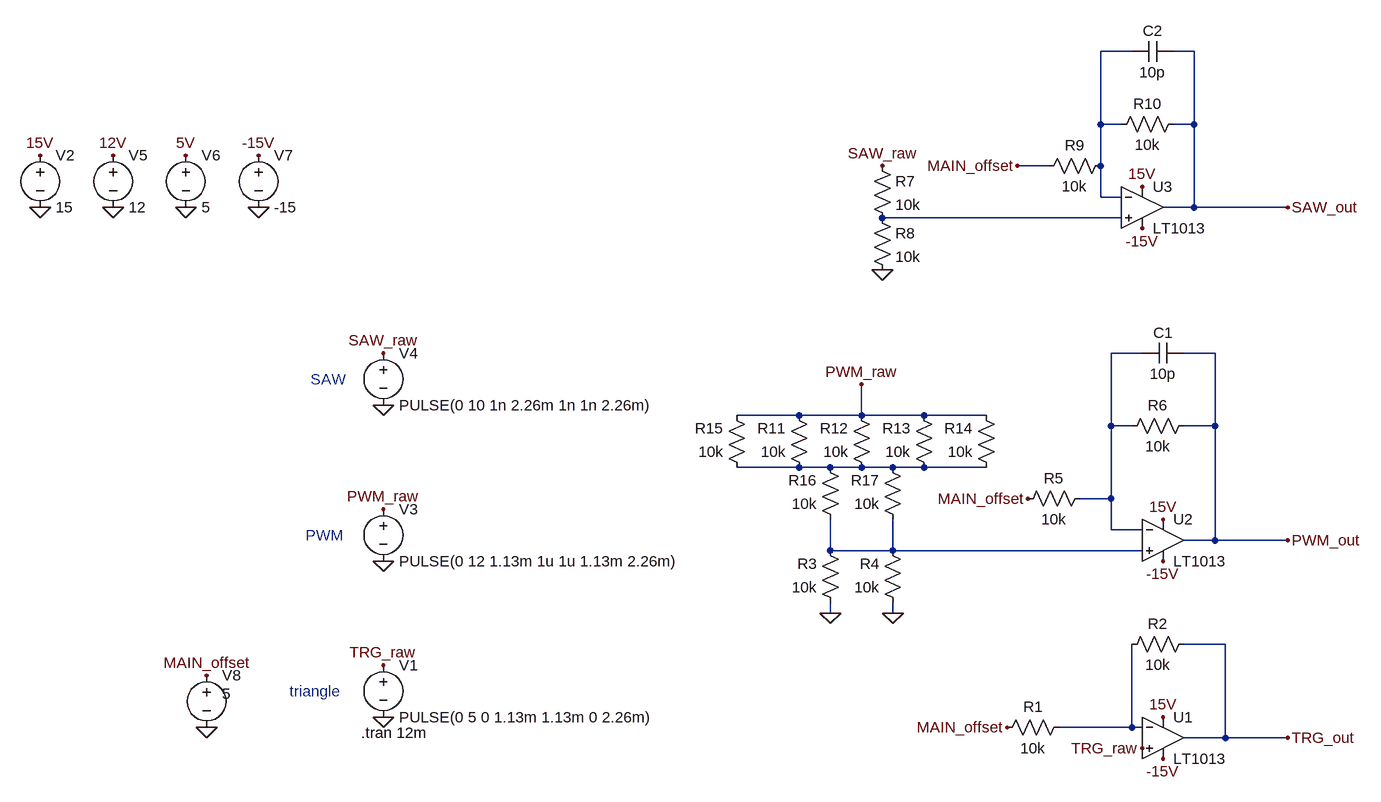
[diagram p0: schematic output_voltage_shifting.asc]
output_voltage_shifting.asc, the LTspice schematic file:
Version 4
SHEET 1 1664 680
WIRE 1216 -752 1168 -752
WIRE 1312 -752 1280 -752
WIRE 1168 -640 1168 -752
WIRE 1200 -640 1168 -640
WIRE 1312 -640 1312 -752
WIRE 1312 -640 1280 -640
WIRE 1088 -576 1040 -576
WIRE 1168 -576 1168 -640
WIRE 1168 -528 1168 -576
WIRE 1200 -528 1168 -528
WIRE 1312 -512 1312 -640
WIRE 1312 -512 1264 -512
WIRE 1456 -512 1312 -512
WIRE 1200 -496 832 -496
WIRE 1232 -288 1184 -288
WIRE 1344 -288 1296 -288
WIRE 704 -192 608 -192
WIRE 800 -192 800 -240
WIRE 800 -192 704 -192
WIRE 896 -192 800 -192
WIRE 992 -192 896 -192
WIRE 1184 -176 1184 -288
WIRE 1216 -176 1184 -176
WIRE 1344 -176 1344 -288
WIRE 1344 -176 1296 -176
WIRE 704 -112 608 -112
WIRE 752 -112 704 -112
WIRE 800 -112 752 -112
WIRE 848 -112 800 -112
WIRE 896 -112 848 -112
WIRE 992 -112 896 -112
WIRE 1184 -64 1184 -176
WIRE 1184 -64 1136 -64
WIRE 1184 -16 1184 -64
WIRE 1232 -16 1184 -16
WIRE 1344 0 1344 -176
WIRE 1344 0 1296 0
WIRE 1456 0 1344 0
WIRE 752 16 752 -32
WIRE 848 16 848 -32
WIRE 848 16 752 16
WIRE 1232 16 848 16
WIRE 752 112 752 96
WIRE 848 112 848 96
WIRE 1360 160 1296 160
WIRE 1216 288 1216 160
WIRE 1216 288 1104 288
WIRE 1232 288 1216 288
WIRE 1360 304 1360 160
WIRE 1360 304 1296 304
WIRE 1456 304 1360 304
FLAG 64 272 0
FLAG 64 32 0
FLAG 64 -208 0
FLAG -464 -512 0
FLAG -352 -512 0
FLAG -240 -512 0
FLAG -128 -512 0
FLAG -464 -592 15V
FLAG -352 -592 12V
FLAG -240 -592 5V
FLAG -128 -592 -15V
FLAG 64 -288 SAW_raw
FLAG 64 -48 PWM_raw
FLAG 64 192 TRG_raw
FLAG -208 288 0
FLAG -208 208 MAIN_offset
FLAG 1232 320 TRG_raw
FLAG 1264 272 15V
FLAG 1264 336 -15V
FLAG 1456 304 TRG_out
FLAG 1264 -32 15V
FLAG 1264 32 -15V
FLAG 1456 0 PWM_out
FLAG 800 -240 PWM_raw
FLAG 752 112 0
FLAG 832 -416 0
FLAG 832 -576 SAW_raw
FLAG 1232 -544 15V
FLAG 1232 -480 -15V
FLAG 1456 -512 SAW_out
FLAG 1024 288 MAIN_offset
FLAG 1056 -64 MAIN_offset
FLAG 1040 -576 MAIN_offset
FLAG 848 112 0
SYMBOL voltage 64 176 R0
WINDOW 123 0 0 Left 0
WINDOW 39 0 0 Left 0
SYMATTR InstName V1
SYMATTR Value PULSE(0 5 0 1.13m 1.13m 0 2.26m)
SYMBOL voltage 64 -64 R0
WINDOW 123 0 0 Left 0
WINDOW 39 0 0 Left 0
SYMATTR InstName V3
SYMATTR Value PULSE(0 12 1.13m 1u 1u 1.13m 2.26m)
SYMBOL voltage 64 -304 R0
WINDOW 123 0 0 Left 0
WINDOW 39 0 0 Left 0
SYMATTR InstName V4
SYMATTR Value PULSE(0 10 1n 2.26m 1n 1n 2.26m)
SYMBOL voltage -464 -608 R0
WINDOW 123 0 0 Left 0
WINDOW 39 0 0 Left 0
SYMATTR InstName V2
SYMATTR Value 15
SYMBOL voltage -352 -608 R0
WINDOW 123 0 0 Left 0
WINDOW 39 0 0 Left 0
SYMATTR InstName V5
SYMATTR Value 12
SYMBOL voltage -240 -608 R0
WINDOW 123 0 0 Left 0
WINDOW 39 0 0 Left 0
SYMATTR InstName V6
SYMATTR Value 5
SYMBOL voltage -128 -608 R0
WINDOW 123 0 0 Left 0
WINDOW 39 0 0 Left 0
SYMATTR InstName V7
SYMATTR Value -15
SYMBOL voltage -208 192 R0
WINDOW 3 24 44 Left 2
WINDOW 123 0 0 Left 0
WINDOW 39 0 0 Left 0
SYMATTR InstName V8
SYMATTR Value 5
SYMBOL res 1120 272 R90
WINDOW 0 0 56 VBottom 2
WINDOW 3 32 56 VTop 2
SYMATTR InstName R1
SYMATTR Value 10k
SYMBOL res 1312 144 R90
WINDOW 0 0 56 VBottom 2
WINDOW 3 32 56 VTop 2
SYMATTR InstName R2
SYMATTR Value 10k
SYMBOL res 1152 -80 R90
WINDOW 0 0 56 VBottom 2
WINDOW 3 32 56 VTop 2
SYMATTR InstName R5
SYMATTR Value 10k
SYMBOL res 1312 -192 R90
WINDOW 0 0 56 VBottom 2
WINDOW 3 32 56 VTop 2
SYMATTR InstName R6
SYMATTR Value 10k
SYMBOL cap 1296 -304 R90
WINDOW 0 0 32 VBottom 2
WINDOW 3 32 32 VTop 2
SYMATTR InstName C1
SYMATTR Value 10p
SYMBOL res 816 -592 R0
SYMATTR InstName R7
SYMATTR Value 10k
SYMBOL res 816 -512 R0
SYMATTR InstName R8
SYMATTR Value 10k
SYMBOL res 1184 -592 R90
WINDOW 0 0 56 VBottom 2
WINDOW 3 32 56 VTop 2
SYMATTR InstName R9
SYMATTR Value 10k
SYMBOL res 1296 -656 R90
WINDOW 0 0 56 VBottom 2
WINDOW 3 32 56 VTop 2
SYMATTR InstName R10
SYMATTR Value 10k
SYMBOL cap 1280 -768 R90
WINDOW 0 0 32 VBottom 2
WINDOW 3 32 32 VTop 2
SYMATTR InstName C2
SYMATTR Value 10p
SYMBOL OpAmps\\LT1013 1264 240 R0
SYMATTR InstName U1
SYMBOL OpAmps\\LT1013 1264 -64 R0
SYMATTR InstName U2
SYMBOL OpAmps\\LT1013 1232 -576 R0
SYMATTR InstName U3
SYMBOL res 768 112 R180
WINDOW 0 36 76 Left 2
WINDOW 3 36 40 Left 2
SYMATTR InstName R3
SYMATTR Value 10k
SYMBOL res 864 112 R180
WINDOW 0 36 76 Left 2
WINDOW 3 36 40 Left 2
SYMATTR InstName R4
SYMATTR Value 10k
SYMBOL res 720 -96 R180
WINDOW 0 36 76 Left 2
WINDOW 3 36 40 Left 2
SYMATTR InstName R11
SYMATTR Value 10k
SYMBOL res 816 -96 R180
WINDOW 0 36 76 Left 2
WINDOW 3 36 40 Left 2
SYMATTR InstName R12
SYMATTR Value 10k
SYMBOL res 912 -96 R180
WINDOW 0 36 76 Left 2
WINDOW 3 36 40 Left 2
SYMATTR InstName R13
SYMATTR Value 10k
SYMBOL res 1008 -96 R180
WINDOW 0 36 76 Left 2
WINDOW 3 36 40 Left 2
SYMATTR InstName R14
SYMATTR Value 10k
SYMBOL res 624 -96 R180
WINDOW 0 36 76 Left 2
WINDOW 3 36 40 Left 2
SYMATTR InstName R15
SYMATTR Value 10k
SYMBOL res 768 -16 R180
WINDOW 0 36 76 Left 2
WINDOW 3 36 40 Left 2
SYMATTR InstName R16
SYMATTR Value 10k
SYMBOL res 864 -16 R180
WINDOW 0 36 76 Left 2
WINDOW 3 36 40 Left 2
SYMATTR InstName R17
SYMATTR Value 10k
TEXT 30 296 Left 2 !.tran 12m
TEXT -48 -248 Left 2 ;SAW
TEXT -56 -8 Left 2 ;PWM
TEXT -80 232 Left 2 ;triangle

The netlist it stands for:
* output_voltage_shifting.asc
V1 TRG_raw 0 PULSE(0 5 0 1.13m 1.13m 0 2.26m)
V3 PWM_raw 0 PULSE(0 12 1.13m 1u 1u 1.13m 2.26m)
V4 SAW_raw 0 PULSE(0 10 1n 2.26m 1n 1n 2.26m)
V2 15V 0 15
V5 12V 0 12
V6 5V 0 5
V7 -15V 0 -15
V8 MAIN_offset 0 5
R1 N006 MAIN_offset 10k
R2 TRG_out N006 10k
R5 N003 MAIN_offset 10k
R6 PWM_out N003 10k
C1 PWM_out N003 10p
R7 SAW_raw N002 10k
R8 N002 0 10k
R9 N001 MAIN_offset 10k
R10 SAW_out N001 10k
C2 SAW_out N001 10p
XU1 TRG_raw N006 15V -15V TRG_out LT1013  ; pins In+ In- V+ V- OUT
XU2 N005 N003 15V -15V PWM_out LT1013  ; pins In+ In- V+ V- OUT
XU3 N002 N001 15V -15V SAW_out LT1013  ; pins In+ In- V+ V- OUT
R3 0 N005 10k
R4 0 N005 10k
R11 N004 PWM_raw 10k
R12 N004 PWM_raw 10k
R13 N004 PWM_raw 10k
R14 N004 PWM_raw 10k
R15 N004 PWM_raw 10k
R16 N005 N004 10k
R17 N005 N004 10k
.tran 12m
* SAW
* PWM
* triangle
.lib LTC.lib
.backanno
.end